# Altium schematic sheet InputOutput.SchDoc: StepMotor Controller
size A4; Organization: NTUST EE-305; Address1: No.43, Sec. 4, Keelung Rd.; Address2: Da’an Dist.; Address3: Taipei 106; Address4: Taiwan (R.O.C.); Revision: 1.0; SheetNumber: 1; SheetTotal: ?
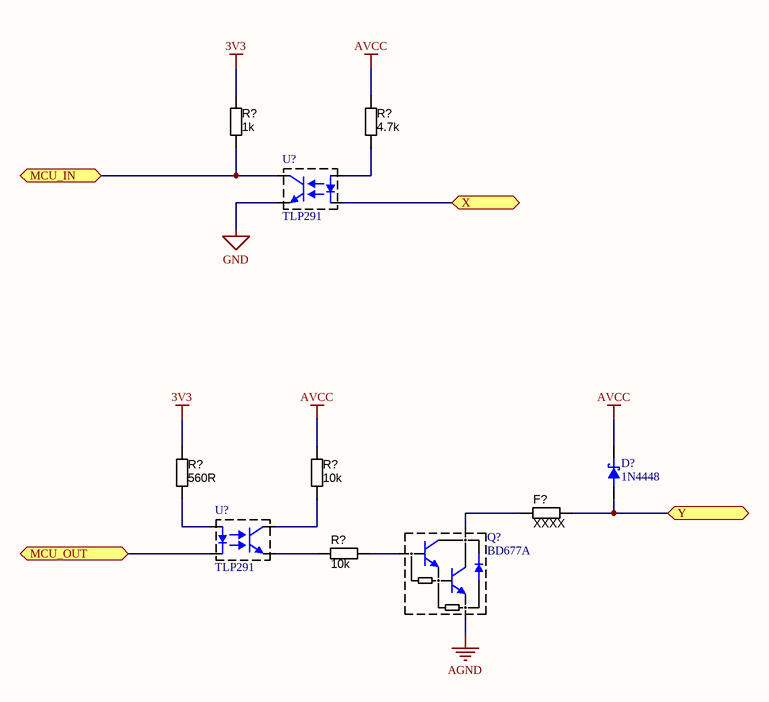
[diagram p0: InputOutput.SchDoc]

## Parts
(Parts that share a designator on the sheet are numbered #1, #2 ... from top to bottom, then left to right.)
D?  1N4448  [SOD323]
F?  XXXX  [RESC1608N]
Q?  BD677A  [TO-126]
R?#1  1k  [RESC1608N]
R?#2  4.7k  [RESC1608N]
R?#3  560R  [RESC1608N]
R?#4  10k  [RESC1608N]
R?#5  10k  [RESC1608N]
U?#1  TLP291  [SO4_N]
U?#2  TLP291  [SO4_N]

## Ports
MCU_IN, MCU_OUT, X, Y

## Nets
3V3: R?#1.1 R?#3.1
AGND: Q?.3(E)
AVCC: D?.1(cathode) R?#2.1 R?#4.1
GND: U?#1.3(EMITTER)
MCU_IN: R?#1.2 U?#1.4(COLLECTOR) ; port MCU_IN
MCU_OUT: U?#2.2(CATHODE) ; port MCU_OUT
X: U?#1.2(CATHODE) ; port X
Y: D?.2(anode) F?.2 ; port Y
NetF?_1: F?.1 Q?.2(C)
NetQ?_1: Q?.1(B) R?#5.2
NetR?#2_2: R?#2.2 U?#1.1(ANODE)
NetR?#3_2: R?#3.2 U?#2.1(ANODE)
NetR?#4_2: R?#4.2 U?#2.4(COLLECTOR)
NetR?#5_1: R?#5.1 U?#2.3(EMITTER)

## Notes on the sheet
- Title
- Name
- Size:
- Revision:
- A4
- Date:
- Time:
- Sheet
- of

## Library data of the parts
D? = 1N4448: SURFACE MOUNT FAST SWITCHING DIODE; Supplier 1: Digi-Key; Supplier Part Number 1: 1N4448HWS-FDICT-ND
F? = Resistor SMD chip: Manufacturer 1: Yageo; Manufacturer Part Number 1: RC0805JR-0710KL; Ratings: 1/8 W; Tolerance: ?%; Material: Thick Film; Package / Case: 0805 (2012 metric); Supplier 1: Digi-Key; Supplier Part Number 1: 311-10KARCT-ND; Value: XXXX
Q? = BD677A: Bipolar (BJT) Transistor NPN - Darlington 60V 4A 40W Through Hole SOT-32-3; Supplier 1: Digi-Key; Supplier Part Number 1: 497-2600-5-ND
R?#1-R?#5 = Resistor SMD chip: Manufacturer 1: Yageo; Manufacturer Part Number 1: RC0805JR-0710KL; Ratings: 1/8 W; Tolerance: ?%; Package / Case: 0805 (2012 metric); Material: Thick Film; Supplier 1: Digi-Key; Supplier Part Number 1: 311-10KARCT-ND
  R?#1: Value: 1k
  R?#2: Value: 4.7k
  R?#3: Value: 560R
  R?#4 R?#5: Value: 10k
U?#1 U?#2 = TLP291: Optoisolator Transistor Output 3750Vrms 1 Channel 4-SO